# EAGLE design PCB-BI8-2x5RGB_MAX6956 (EAGLE 7.5.0)
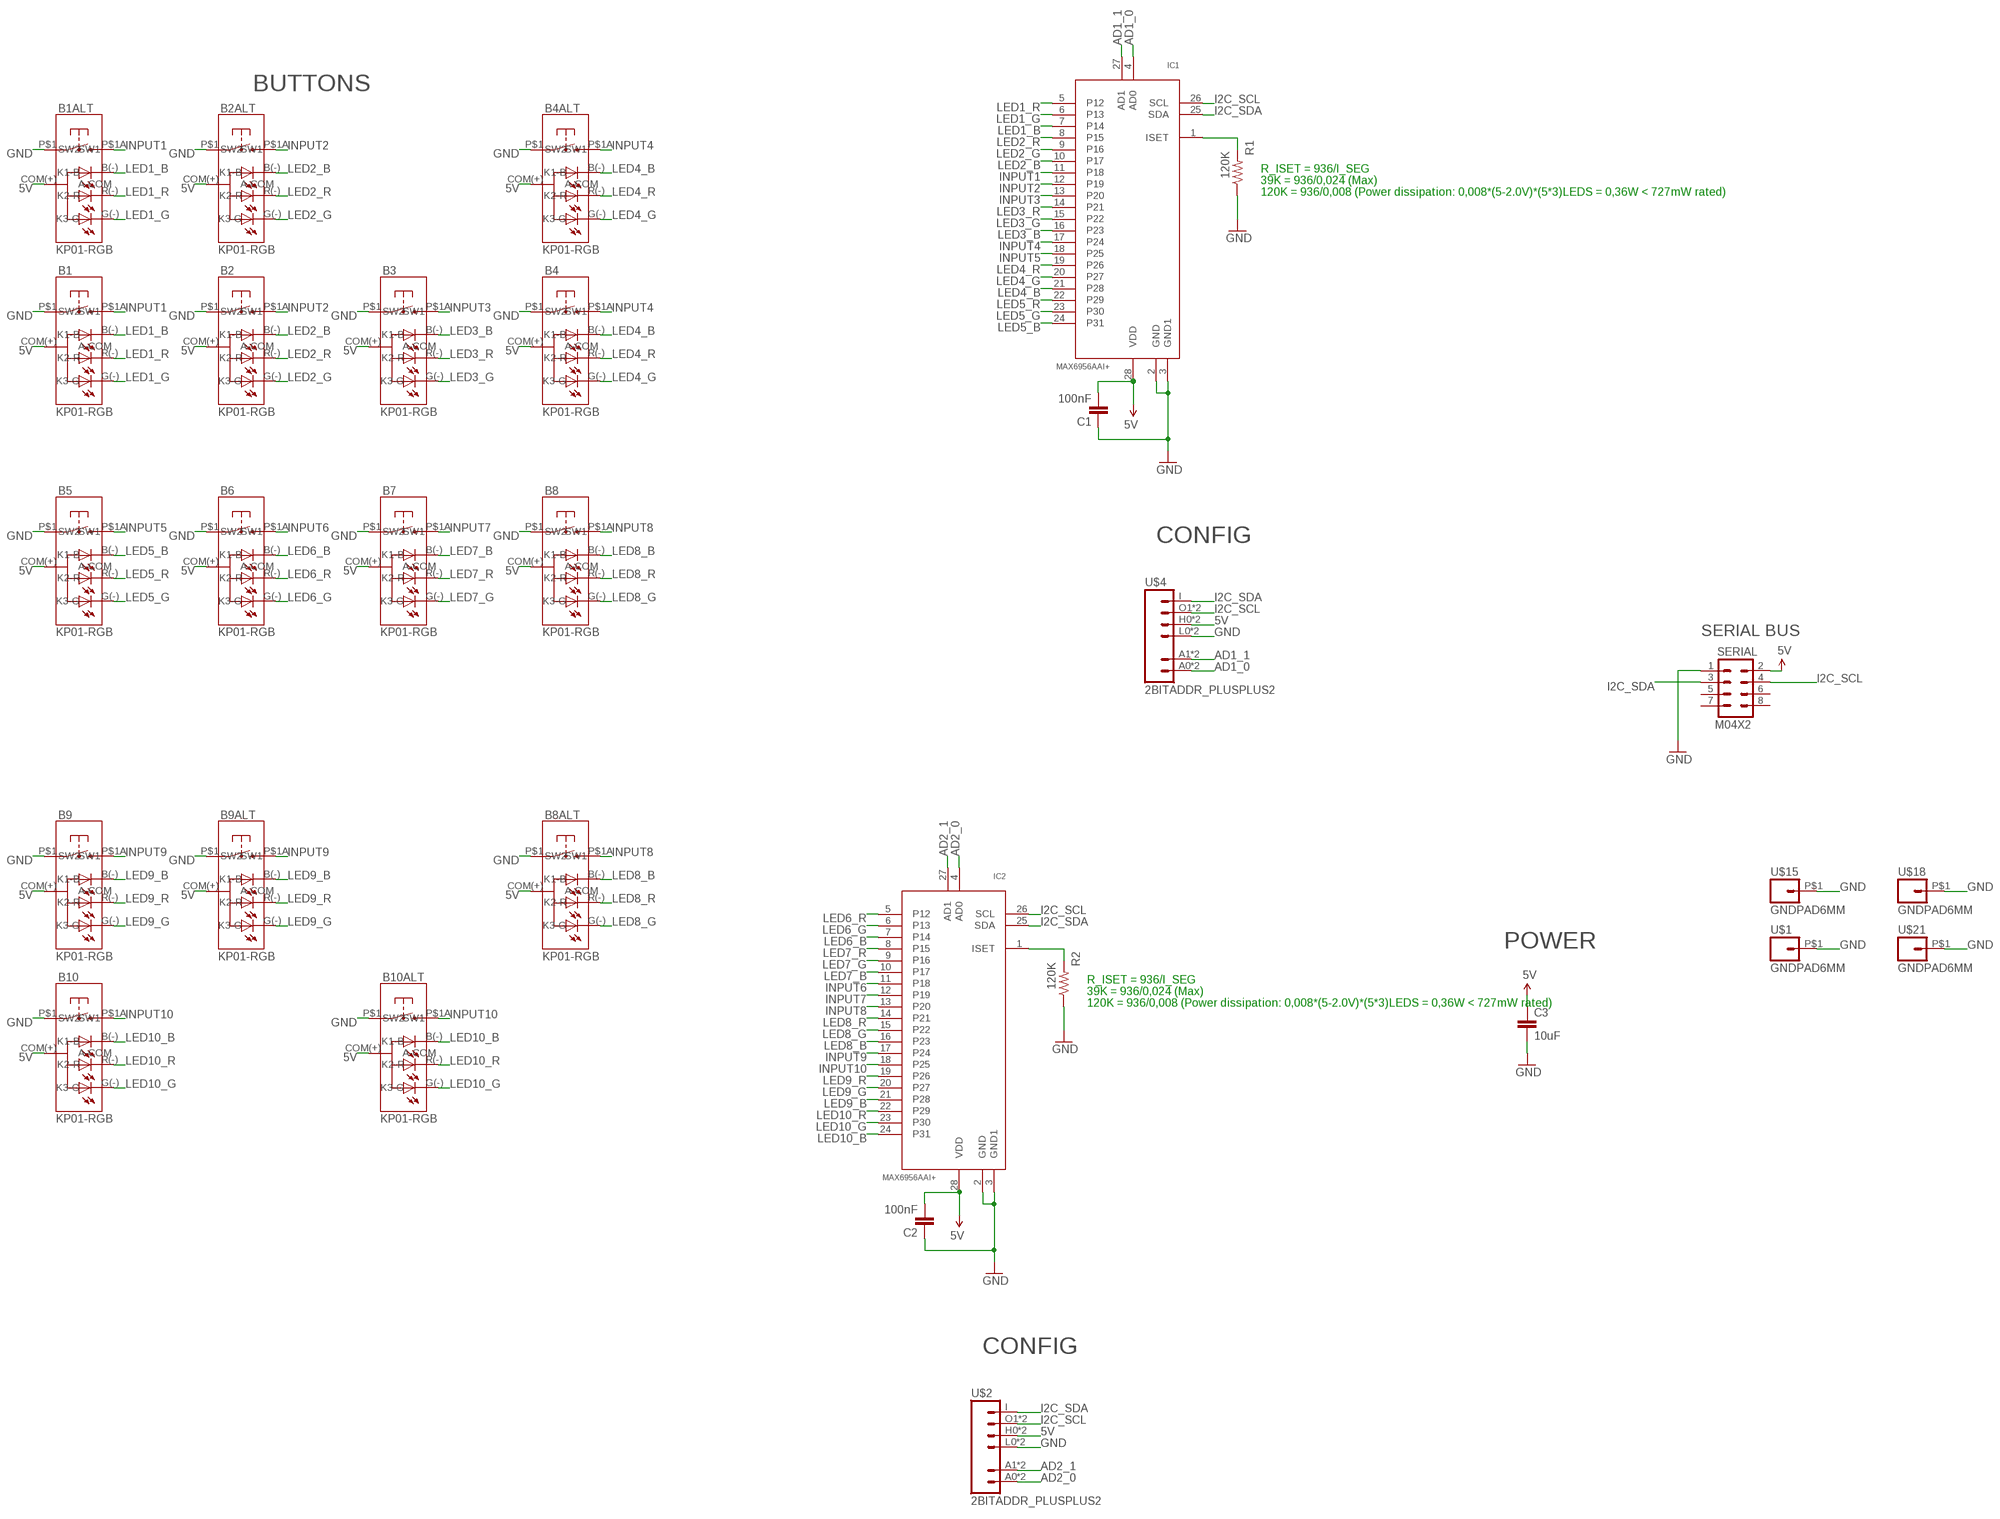
[diagram p0: schematic, sheet 1]

## Parts
B1  KP01-RGB  NKK-KP01  [NKK-KP01]
B1ALT  KP01-RGB  NKK-KP01  [NKK-KP01]
B2  KP01-RGB  NKK-KP01  [NKK-KP01]
B2ALT  KP01-RGB  NKK-KP01  [NKK-KP01]
B3  KP01-RGB  NKK-KP01  [NKK-KP01]
B4  KP01-RGB  NKK-KP01  [NKK-KP01]
B4ALT  KP01-RGB  NKK-KP01  [NKK-KP01]
B5  KP01-RGB  NKK-KP01  [NKK-KP01]
B6  KP01-RGB  NKK-KP01  [NKK-KP01]
B7  KP01-RGB  NKK-KP01  [NKK-KP01]
B8  KP01-RGB  NKK-KP01  [NKK-KP01]
B8ALT  KP01-RGB  NKK-KP01  [NKK-KP01]
B9  KP01-RGB  NKK-KP01  [NKK-KP01]
B9ALT  KP01-RGB  NKK-KP01  [NKK-KP01]
B10  KP01-RGB  NKK-KP01  [NKK-KP01]
B10ALT  KP01-RGB  NKK-KP01  [NKK-KP01]
C1  100nF  CAP0603-CAP  [0603-CAP]
C2  100nF  CAP0603-CAP  [0603-CAP]
C3  10uF  CAP0805  [0805]
IC1  MAX6956AAI+  [SSOP28]
IC2  MAX6956AAI+  [SSOP28]
R1  120K  RESISTOR0603-RES  [0603-RES]
R2  120K  RESISTOR0603-RES  [0603-RES]
SERIAL  M04X2  [2X4]
U$1  GNDPAD6MM  [3.2MMPAD6MM]
U$2  2BITADDR_PLUSPLUS2  [2BITADDR_SMALL_PLUS2]
U$4  2BITADDR_PLUSPLUS2  [2BITADDR_SMALL_PLUS2]
U$15  GNDPAD6MM  [3.2MMPAD6MM]
U$18  GNDPAD6MM  [3.2MMPAD6MM]
U$21  GNDPAD6MM  [3.2MMPAD6MM]

## Nets
5V [Power]: B1.COM(+)(A-COM) B1ALT.COM(+)(A-COM) B2.COM(+)(A-COM) B2ALT.COM(+)(A-COM) B3.COM(+)(A-COM) B4.COM(+)(A-COM) B4ALT.COM(+)(A-COM) B5.COM(+)(A-COM) B6.COM(+)(A-COM) B7.COM(+)(A-COM) B8.COM(+)(A-COM) B8ALT.COM(+)(A-COM) B9.COM(+)(A-COM) B9ALT.COM(+)(A-COM) B10.COM(+)(A-COM) B10ALT.COM(+)(A-COM) C1.2 C2.2 C3.1 IC1.28(VDD) IC2.28(VDD) SERIAL.2 U$2.H0(VCC) U$2.H1(VCC) U$4.H0(VCC) U$4.H1(VCC)
AD1_0: IC1.4(AD0) U$4.A0(A1) U$4.AS0(A1)
AD1_1: IC1.27(AD1) U$4.A1(A2) U$4.AS1(A2)
AD2_0: IC2.4(AD0) U$2.A0(A1) U$2.AS0(A1)
AD2_1: IC2.27(AD1) U$2.A1(A2) U$2.AS1(A2)
GND [Power]: B1.P$1(SW1) B1ALT.P$1(SW1) B2.P$1(SW1) B2ALT.P$1(SW1) B3.P$1(SW1) B4.P$1(SW1) B4ALT.P$1(SW1) B5.P$1(SW1) B6.P$1(SW1) B7.P$1(SW1) B8.P$1(SW1) B8ALT.P$1(SW1) B9.P$1(SW1) B9ALT.P$1(SW1) B10.P$1(SW1) B10ALT.P$1(SW1) C1.1 C2.1 C3.2 IC1.2(GND) IC1.3(GND1) IC2.2(GND) IC2.3(GND1) R1.1 R2.1 SERIAL.1 U$1.P$1 U$2.L0(GND) U$2.L1(GND) U$4.L0(GND) U$4.L1(GND) U$15.P$1 U$18.P$1 U$21.P$1
I2C_SCL: IC1.26(SCL) IC2.26(SCL) SERIAL.4 U$2.O1 U$2.O2 U$4.O1 U$4.O2
I2C_SDA: IC1.25(SDA) IC2.25(SDA) SERIAL.3 U$2.I U$4.I
INPUT1: B1.P$1A(SW2) B1ALT.P$1A(SW2) IC1.11(P18)
INPUT2: B2.P$1A(SW2) B2ALT.P$1A(SW2) IC1.12(P19)
INPUT3: B3.P$1A(SW2) IC1.13(P20)
INPUT4: B4.P$1A(SW2) B4ALT.P$1A(SW2) IC1.17(P24)
INPUT5: B5.P$1A(SW2) IC1.18(P25)
INPUT6: B6.P$1A(SW2) IC2.11(P18)
INPUT7: B7.P$1A(SW2) IC2.12(P19)
INPUT8: B8.P$1A(SW2) B8ALT.P$1A(SW2) IC2.13(P20)
INPUT9: B9.P$1A(SW2) B9ALT.P$1A(SW2) IC2.17(P24)
INPUT10: B10.P$1A(SW2) B10ALT.P$1A(SW2) IC2.18(P25)
LED1_B: B1.B(-)(K1-B) B1ALT.B(-)(K1-B) IC1.7(P14)
LED1_G: B1.G(-)(K3-G) B1ALT.G(-)(K3-G) IC1.6(P13)
LED1_R: B1.R(-)(K2-R) B1ALT.R(-)(K2-R) IC1.5(P12)
LED2_B: B2.B(-)(K1-B) B2ALT.B(-)(K1-B) IC1.10(P17)
LED2_G: B2.G(-)(K3-G) B2ALT.G(-)(K3-G) IC1.9(P16)
LED2_R: B2.R(-)(K2-R) B2ALT.R(-)(K2-R) IC1.8(P15)
LED3_B: B3.B(-)(K1-B) IC1.16(P23)
LED3_G: B3.G(-)(K3-G) IC1.15(P22)
LED3_R: B3.R(-)(K2-R) IC1.14(P21)
LED4_B: B4.B(-)(K1-B) B4ALT.B(-)(K1-B) IC1.21(P28)
LED4_G: B4.G(-)(K3-G) B4ALT.G(-)(K3-G) IC1.20(P27)
LED4_R: B4.R(-)(K2-R) B4ALT.R(-)(K2-R) IC1.19(P26)
LED5_B: B5.B(-)(K1-B) IC1.24(P31)
LED5_G: B5.G(-)(K3-G) IC1.23(P30)
LED5_R: B5.R(-)(K2-R) IC1.22(P29)
LED6_B: B6.B(-)(K1-B) IC2.7(P14)
LED6_G: B6.G(-)(K3-G) IC2.6(P13)
LED6_R: B6.R(-)(K2-R) IC2.5(P12)
LED7_B: B7.B(-)(K1-B) IC2.10(P17)
LED7_G: B7.G(-)(K3-G) IC2.9(P16)
LED7_R: B7.R(-)(K2-R) IC2.8(P15)
LED8_B: B8.B(-)(K1-B) B8ALT.B(-)(K1-B) IC2.16(P23)
LED8_G: B8.G(-)(K3-G) B8ALT.G(-)(K3-G) IC2.15(P22)
LED8_R: B8.R(-)(K2-R) B8ALT.R(-)(K2-R) IC2.14(P21)
LED9_B: B9.B(-)(K1-B) B9ALT.B(-)(K1-B) IC2.21(P28)
LED9_G: B9.G(-)(K3-G) B9ALT.G(-)(K3-G) IC2.20(P27)
LED9_R: B9.R(-)(K2-R) B9ALT.R(-)(K2-R) IC2.19(P26)
LED10_B: B10.B(-)(K1-B) B10ALT.B(-)(K1-B) IC2.24(P31)
LED10_G: B10.G(-)(K3-G) B10ALT.G(-)(K3-G) IC2.23(P30)
LED10_R: B10.R(-)(K2-R) B10ALT.R(-)(K2-R) IC2.22(P29)
N$1: IC2.1(ISET) R2.2
N$5: IC1.1(ISET) R1.2
Unconnected: SERIAL.5 SERIAL.6 SERIAL.7 SERIAL.8

## Notes on the sheet
- BUTTONS
- R_ISET = 936/I_SEG
- 39K = 936/0,024 (Max)
- 120K = 936/0,008 (Power dissipation: 0,008*(5-2.0V)*(5*3)LEDS = 0,36W < 727mW rated)
- CONFIG
- SERIAL BUS
- POWER
- R_ISET = 936/I_SEG
- 39K = 936/0,024 (Max)
- 120K = 936/0,008 (Power dissipation: 0,008*(5-2.0V)*(5*3)LEDS = 0,36W < 727mW rated)
- CONFIG

## Library data of the parts
B1 B1ALT B2 B2ALT B3 B4 B4ALT B5-B8 B8ALT B9 B9ALT B10 B10ALT = SKAARHOJ:NKK-KP01: NKK-KP01-15AC 100mA12VDC
C1-C3 = SparkFun:CAP: Capacitor Standard 0603 ceramic capacitor, and 0.1" leaded capacitor.
IC1 IC2 = SKAARHOJ:MAX6956AAI+
R1 R2 = SparkFun:RESISTOR: Resistor Basic schematic elements and footprints for 0603, 1206, and PTH resistors.
SERIAL = SparkFun:M04X2
U$1 U$15 U$18 U$21 = SKAARHOJ:GNDPAD
U$2 U$4 = SKAARHOJ:2BITADDR_PLUS

## Net classes
0 default: width 0.203 mm, drill 0.254 mm, clearance 0.203 mm
1 Power: width 0.406 mm, drill 0.61 mm, clearance 0.254 mm

## Board
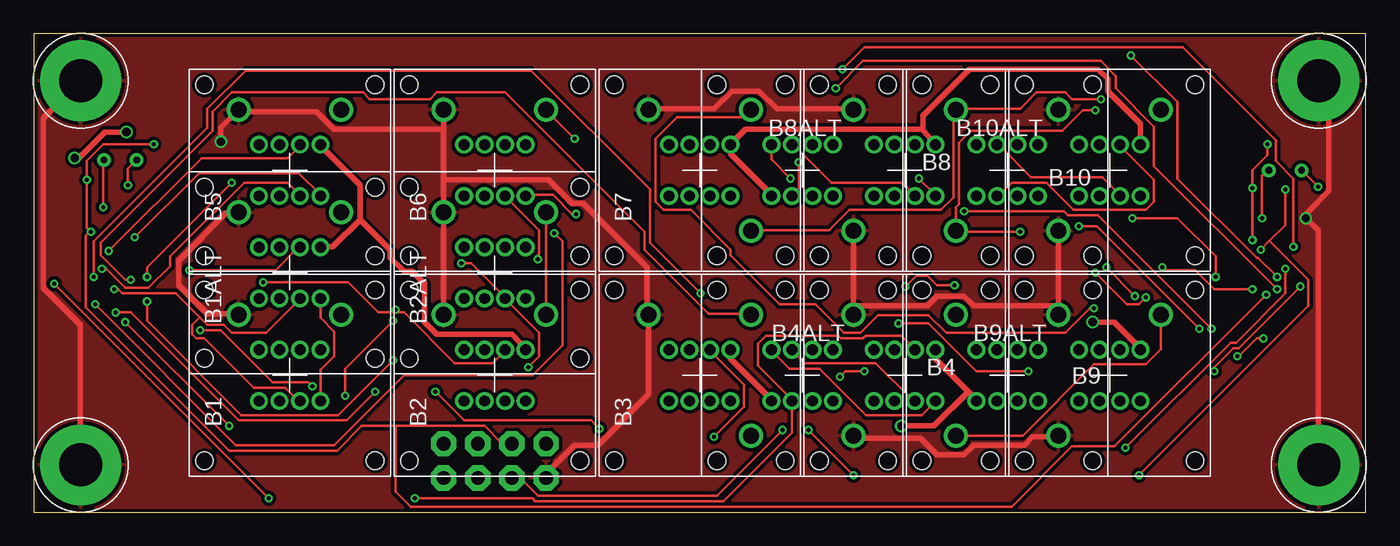
[diagram p1: board, top side]
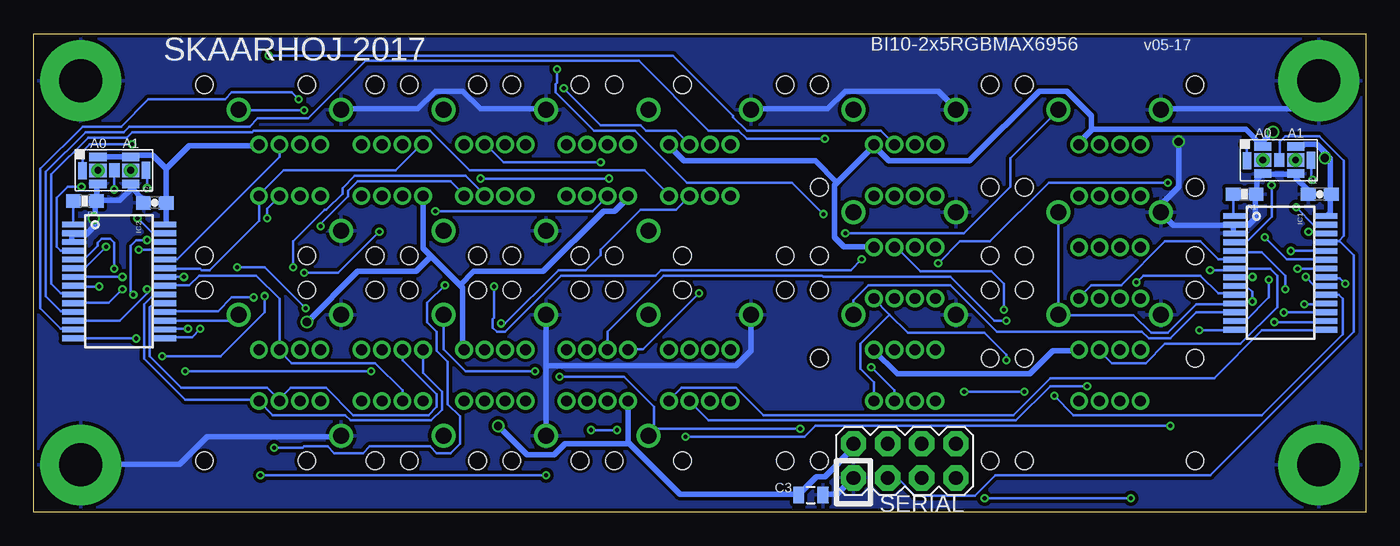
[diagram p2: board, bottom side, seen from below]

Size 99.06 x 35.56 mm. Coordinates in mm from the lower left corner, seen from the top.
Outline: 0,0 99.06,0 99.06,35.56 0,35.56 0,0
Copper layers (1*16): Top 0.035mm / dielectric 1.5mm / Bottom 0.035mm
Design rules "Fusion_eagle_rule_v1.1": minimum track width 6mil, minimum drill 12mil, track to track 6mil, track to pad 6mil, pad to pad 6mil, via to via 6mil, smd to smd 0mil, copper to edge 10mil, drill to drill 10mil, minimum pad ring 10mil, minimum via ring 6mil, stop-mask expansion 2mil, vias tented up to drill 100mil, thermal gap 10mil

### Footprints (pad centres in the part's own frame; a part is rotated, then mirrored left to right if it is on the bottom)
NKK-KP01 = drill 0.8: B(-) 1.905,-0.762; COM(+) 1.905,-2.286; G(-) -1.905,-2.286; P$3 1.905,0.762; P$4 1.905,2.286; P$7 -1.905,0.762; P$8 -1.905,2.286; R(-) -1.905,-0.762 | drill 1.2: P$1 4.496,3.81; P$1A 4.496,-3.81 | hole 1.3: -6.35,6.35; 6.35,6.35; 6.35,-6.35; -6.35,-6.35
0603-CAP = smd 1.1 x 1: 1 -0.85,0; 2 0.85,0
0805 = smd 0.8 x 1.2: 1 -0.9,0; 2 0.9,0
SSOP28 = smd 0.42 x 1.62: 1 -4.225,-3.425; 2 -3.575,-3.425; 3 -2.925,-3.425; 4 -2.275,-3.425; 5 -1.625,-3.425; 6 -0.975,-3.425; 7 -0.325,-3.425; 8 0.325,-3.425; 9 0.975,-3.425; 10 1.625,-3.425; 11 2.275,-3.425; 12 2.925,-3.425; 13 3.575,-3.425; 14 4.225,-3.425; 15 4.225,3.425; 16 3.575,3.425; 17 2.925,3.425; 18 2.275,3.425; 19 1.625,3.425; 20 0.975,3.425; 21 0.325,3.425; 22 -0.325,3.425; 23 -0.975,3.425; 24 -1.625,3.425; 25 -2.275,3.425; 26 -2.925,3.425; 27 -3.575,3.425; 28 -4.225,3.425
0603-RES = smd 1.1 x 1: 1 -0.85,0; 2 0.85,0
2X4 = drill 1.016 pad 1.88 octagon: 1 -3.81,-1.27; 2 -3.81,1.27; 3 -1.27,-1.27; 4 -1.27,1.27; 5 1.27,-1.27; 6 1.27,1.27; 7 3.81,-1.27; 8 3.81,1.27
3.2MMPAD6MM = drill 3.2 pad 6: P$1 0,0
2BITADDR_SMALL_PLUS2 = drill 0.5: A0 -1.565,0; A1 0.87,0 | smd 1.27 x 1: AS0 -1.565,0; AS1 0.87,0 | smd 1.27 x 0.635: H0 -1.565,1; H1 0.87,1; L0 -1.565,-1; L1 0.87,-1 | smd 0.762 x 1.016: I -0.336,0 | smd 0.635 x 1.27: O1 -2.727,-0.041; O2 2.004,0

### Placement (x,y rotation side)
B1  19.05,10.16 90 top
B1ALT  19.05,17.78 90 top
B2  34.29,10.16 90 top
B2ALT  34.29,17.78 90 top
B3  49.53,10.16 90 top
B4  64.77,10.16 90 top
B4ALT  57.15,10.16 270 top
B5  19.05,25.4 90 top
B6  34.29,25.4 90 top
B7  49.53,25.4 90 top
B8  64.77,25.4 90 top
B8ALT  57.15,25.4 270 top
B9  80.01,10.16 90 top
B9ALT  72.39,10.16 270 top
B10  80.01,25.4 90 top
B10ALT  72.39,25.4 270 top
C1  3.43,23.62 0 bottom
C2  90.04,22.99 0 bottom
C3  41.27,1.27 0 bottom
IC1  6.35,17.78 270 bottom
IC2  92.71,17.14 270 bottom
R1  9.02,23.62 180 bottom
R2  95.25,23.11 180 bottom
SERIAL  34.29,3.81 0 bottom
U$1  3.5,3.5 0 top
U$2  92.71,25.4 0 bottom
U$4  6.1,26.16 0 bottom
U$15  3.5,32.06 0 top
U$18  95.56,32.06 0 top
U$21  95.56,3.5 0 top

### Tracks (layer width: path | path; a pad name or v marks a point on that pad's centre or on a via)
5V  (via drill 0.61)
  Top 0.406: B3.COM(+) 51.82,11.38 54.86,8.33 B4ALT.COM(+) | B4.COM(+) 67.06,11.38 69.49,8.94 | 69.49,8.94 70.1,8.33 B9ALT.COM(+) | v78.74,14.12 80.37,14.12 81.89,12.6 81.89,12.5 82.3,12.09 B9.COM(+) | v64.52,6.4 66.95,6.4 69.49,8.94 | 24.28,21.74 22.25,19.71 21.34,19.71 B1ALT.COM(+) | 24.28,21.74 24.28,24.28 21.34,27.23 B5.COM(+) | v3.05,26.31 3.35,26.31 5.28,28.25 v6.91,28.25 | 24.28,21.74 26.52,19.51 26.52,18.9 27.53,17.88 28.14,17.88 29.06,16.97 29.06,14.12 29.97,13.21 35.56,13.21 36.17,12.6 36.17,12.5 36.58,12.09 B2.COM(+) | B8ALT.COM(+) 54.86,23.57 51.82,26.62 B7.COM(+) 51.92,27.43 52.93,28.45 66.04,28.45 | 66.04,28.45 66.65,27.84 66.65,27.74 67.06,27.33 B8.COM(+) | B10.COM(+) 82.3,28.85 79.86,31.29 79.86,32.21 79.15,32.92 69.6,32.92 66.14,29.46 66.14,28.55 66.04,28.45
  Bottom 0.406: SERIAL.2 38.1,4.78 40.23,2.64 40.84,2.64 42.16,1.32 C3.1 42.37,1.32 51,1.32 54.86,5.18 | 54.86,5.18 B4ALT.COM(+) | B10ALT.COM(+) 70.1,19.61 69.49,19 | 67.36,16.87 67.16,16.66 67.16,12.19 67.06,12.09 B4.COM(+) | 67.36,16.87 69.49,19 | v78.74,14.12 74.98,17.88 70.61,17.88 69.49,19 | v64.52,6.4 62.38,4.27 60.35,4.27 59.54,5.08 54.97,5.08 54.86,5.18 | B1.COM(+) 21.34,11.99 23.27,11.99 24.99,10.26 34.85,10.26 36.58,11.99 B2.COM(+) | IC1.28 2.85,22.05 2.64,22.25 2.64,23.57 C1.2 2.64,23.77 2.64,26.31 2.85,26.52 | 2.85,26.52 3.66,27.33 4.57,27.33 4.67,27.23 5.18,27.23 U$4.H1 | 20.32,28.45 8.94,28.45 7.72,27.23 U$4.H0 7.72,27.43 v6.91,28.25 | 20.32,28.45 21.34,27.43 B5.COM(+) | v3.05,26.31 2.85,26.52 | IC2.28 89.2,21.44 89.2,22.96 C2.2 89.2,23.16 89.2,25.5 | U$2.H0 94.18,26.42 91.85,26.42 U$2.H1 91.75,26.52 90.22,26.52 89.2,25.5 | 89.2,25.5 87.48,27.23 82.3,27.23 B10.COM(+) | 39.32,24.49 36.58,27.23 B6.COM(+) 36.47,27.13 35.46,26.11 29.46,26.11 24.28,31.29 22.25,31.29 20.42,29.46 20.42,28.55 20.32,28.45 | 39.32,24.49 39.52,24.28 39.52,20.42 38.81,19.71 36.58,19.71 B2ALT.COM(+) | 39.32,24.49 40.95,26.11 50.7,26.11 51.82,27.23 B7.COM(+) | 67.36,16.87 66.34,17.88 61.16,17.88 56.69,22.35 55.88,22.35 54.86,23.37 B8ALT.COM(+)
AD1_0  (via drill 0.3)
  Top 0.203: v7.01,24.28 7.01,25.5 7.62,26.11 U$4.A0
  Bottom 0.203: 7.72,26.21 U$4.A0 | v7.01,24.28 7.01,21.95 8.94,20.02 9.75,20.02 IC1.4
AD1_1  (via drill 0.3)
  Top 0.203: v5.18,22.66 5.18,26.11 U$4.AS1
  Bottom 0.203: 5.28,26.21 U$4.AS1 | v5.18,22.66 3.86,21.34 2.95,21.34 IC1.27
AD2_0  (via drill 0.3)
  Top 0.203: v95.5,24.18 94.28,25.4 U$2.A0
  Bottom 0.203: 94.28,25.4 U$2.A0 | v95.5,24.18 96.52,24.18 97.33,23.37 97.33,19.71 97.03,19.41 96.22,19.41 IC2.4
AD2_1  (via drill 0.3)
  Top 0.203: v91.34,21.84 91.34,24.99 91.75,25.4 U$2.AS1
  Bottom 0.203: U$2.AS1 | v91.34,21.84 90.22,20.73 89.31,20.73 IC2.27
GND  (via drill 0.61)
  Top 0.406: U$18.P$1 95.61,32 96.32,31.29 96.32,23.88 94.59,22.15 v94.59,21.84 95.5,20.93 95.5,3.56 U$21.P$1 | SERIAL.1 38.1,2.85 40.23,4.98 41.96,4.98 45.72,8.74 B3.P$1 45.62,14.83 45.62,18.19 40.84,22.96 40.03,22.96 38.3,24.69 30.48,24.69 | B10ALT.P$1 B9.P$1 76.1,15.34 69.9,15.34 69.19,16.05 67.16,16.05 66.45,15.34 61.06,15.34 B4.P$1 B8ALT.P$1 | B9ALT.P$1 76.2,5.59 74.27,5.59 73.66,4.98 69.9,4.98 69.19,4.27 67.16,4.27 65.94,5.49 61.06,5.49 60.96,5.59 B4ALT.P$1 | B1.P$1 15.24,14.73 12.9,14.73 10.77,16.87 10.77,18.69 14.33,22.25 15.24,22.25 B1ALT.P$1 | v13.92,27.53 13.92,28.55 15.24,29.87 B5.P$1 15.34,29.77 21.03,29.77 22.35,28.45 30.48,28.45 | U$1.P$1 3.45,3.56 3.45,13.92 0.71,16.66 0.71,29.26 3.45,32 U$15.P$1 | B2.P$1 B2ALT.P$1 30.48,24.69 | 30.48,24.69 30.48,28.45 | 30.48,28.45 B6.P$1 | B8.P$1 60.96,29.97 55.27,29.97 53.95,31.29 51.92,31.29 50.6,29.97 45.72,29.97 B7.P$1
  Bottom 0.406: IC2.3 96.22,20.12 96.22,20.62 IC2.2 96.01,20.62 95.2,20.62 94.49,21.34 94.49,21.84 | R2.1 94.39,23.16 94.39,24.28 94.28,24.38 U$2.L0 | 91.75,24.08 90.93,23.27 90.93,23.06 C2.1 | 91.75,24.08 91.75,24.38 U$2.L1 | 91.75,24.08 92.66,23.16 94.18,23.16 R2.1 | 94.49,21.84 94.49,22.96 R2.1 | v94.59,21.84 94.49,21.84 | SERIAL.1 39.32,1.32 40.34,1.32 C3.2 | B4.P$1 60.96,10.87 | 60.96,10.87 B4ALT.P$1 | B3.P$1 45.72,11.99 46.84,10.87 60.96,10.87 | U$21.P$1 95.5,3.56 88.19,3.56 86.16,5.59 76.2,5.59 B9ALT.P$1 | C1.1 4.37,23.67 4.37,23.98 5.18,24.79 5.18,25.09 U$4.L1 5.38,25.09 7.52,25.09 U$4.L0 7.72,25.09 8.13,24.69 8.13,23.67 R1.1 8.23,23.47 8.23,21.84 8.74,21.34 9.65,21.34 IC1.2 | IC1.3 9.86,20.73 9.86,21.34 IC1.2 | IC1.2 10.06,21.34 14.33,21.34 15.24,22.25 B1ALT.P$1 15.14,22.45 15.14,22.96 13.92,24.18 v13.92,27.53 | U$15.P$1 5.59,29.97 15.24,29.97 B5.P$1 | B7.P$1 45.72,29.97 40.03,29.97 38.71,31.29 31.8,31.29 30.48,29.97 B6.P$1 | B10.P$1 76.2,29.97 70.51,29.97 69.19,31.29 67.16,31.29 65.84,29.97 60.96,29.97 B8.P$1
  pour Top: 0,0 99.06,0 99.06,35.56 0,35.56
  pour Bottom: 0,0 99.06,0 99.06,35.56 0,35.56
I2C_SCL  (via drill 0.3)
  Top 0.203: v90.63,20.22 v90.63,24.08 90.63,25.4 91.75,26.52 v91.75,27.33 | v8.94,27.33 5.18,27.33 3.96,26.11 v3.96,24.69 3.96,21.13 v4.27,20.83 4.17,20.83 3.86,20.52 3.86,15.24 14.53,4.57 22.55,4.57 24.38,6.4 26.92,6.4 | SERIAL.4 34.85,5.08 33.53,6.4 26.92,6.4 | v91.64,16.15 80.37,4.88 77.22,4.88 72.75,0.41 28.04,0.41 26.92,1.52 26.92,6.4
  Bottom 0.203: v90.63,24.08 90.63,25.4 U$2.O2 | IC2.26 89.31,20.12 90.22,20.12 90.32,20.22 v90.63,20.22 91.44,20.22 91.85,19.81 91.85,16.36 v91.64,16.15 | v91.75,27.33 94.89,27.33 95.4,26.82 95.4,25.4 U$2.O1 | v3.96,24.69 4.06,24.79 4.06,26.11 U$4.O2 | v4.27,20.83 3.05,20.83 IC1.26 | v8.94,27.33 8.84,27.23 8.84,26.21 U$4.O1
I2C_SDA  (via drill 0.3)
  Top 0.203: v93.07,23.98 93.07,21.34 91.9,20.17 | v91.24,19.51 91.9,20.17 | 91.9,20.17 94.79,17.27 94.79,15.34 v82.19,2.74 | v57.61,6.1 v60.96,2.74 | v55.68,6.1 50.8,1.22 37.49,1.22 36.17,2.54 SERIAL.3
  Bottom 0.203: v93.07,23.98 93.07,25.4 U$2.I | v91.24,19.51 89.31,19.51 IC2.25 | 1.98,20.17 2.03,20.12 2.85,20.12 IC1.25 | 1.98,20.17 1.63,20.52 1.63,26.11 3.45,27.94 5.99,27.94 6.4,27.53 6.4,26.21 U$4.I | SERIAL.3 34.85,2.54 33.53,1.22 29.06,1.22 27.53,2.74 11.58,2.74 0.91,13.41 0.91,19.1 1.98,20.17 | v60.96,2.74 v82.19,2.74 | v55.68,6.1 v57.61,6.1
INPUT1
  Bottom 0.203: IC1.11 9.86,15.44 12.6,15.44 14.73,13.31 15.95,13.31 17.27,14.63 22.86,14.63 B1.P$1A B1ALT.P$1A
INPUT2
  Top 0.203: B2.P$1A B2ALT.P$1A
  Bottom 0.203: B2.P$1A 38.1,15.75 36.98,16.87 30.89,16.87 27.43,13.41 16.66,13.41 16.15,12.9 14.53,12.9 12.6,14.83 9.86,14.83 IC1.12
INPUT3  (via drill 0.3)
  Top 0.203: v7.21,17.27 6.81,17.27 4.98,19.1 4.98,20.02 13.31,28.35 13.31,29.77 14.73,31.19 24.49,31.19 24.99,30.68 29.46,30.68 29.97,31.19 35.05,31.19 45.41,20.83 45.41,19.51 50.19,14.73 53.34,14.73 B3.P$1A
  Bottom 0.203: v7.21,17.27 7.21,15.95 8.94,14.22 9.75,14.22 IC1.13
INPUT4  (via drill 0.3)
  Top 0.203: v6.1,14.83 7.21,14.83 15.24,6.81 23.27,6.81 v25.4,8.94 | v29.87,8.94 32,6.81 41.45,6.81 v42.06,6.2 | v61.77,10.46 60.35,10.46 v59.94,10.06
  Bottom 0.203: v6.1,14.83 2.95,14.83 IC1.17 | v29.87,8.94 v25.4,8.94 | v42.06,6.2 52.83,6.2 53.34,5.69 B4ALT.P$1A 52.93,6.2 52.93,7.82 55.17,10.06 v59.94,10.06 | B4.P$1A 68.58,12.09 66.95,10.46 v61.77,10.46
INPUT5  (via drill 0.3)
  Top 0.203: v4.57,15.44 15.04,4.98 22.35,4.98 27.53,10.16 37.08,10.16 39.32,12.39 39.32,20.12 v38.71,20.73
  Bottom 0.203: v4.57,15.44 2.95,15.44 IC1.18 | v38.71,20.73 29.87,20.73 26.42,24.18 26.42,26.31 22.86,29.87 B5.P$1A
INPUT6  (via drill 0.3)
  Top 0.203: v40.23,27.74 38.1,29.87 B6.P$1A
  Bottom 0.203: v40.23,27.74 46.02,27.74 46.63,28.35 48.87,28.35 54.05,33.53 74.37,33.53 78.64,29.26 82.4,29.26 83.01,28.65 91.95,28.65 92.35,28.25 95.2,28.25 98.15,25.3 98.15,16.05 97.03,14.94 96.22,14.94 IC2.11
INPUT7  (via drill 0.3)
  Top 0.203: v90.63,16.56 87.78,16.56 86.36,17.98 84.12,17.98 v83.92,18.19 | v78.84,15.14 78.54,15.14 76.71,13.31 67.87,13.31 66.55,14.63 62.79,14.63 61.47,13.31 60.25,13.31 58.12,15.44 55.47,15.44 51.82,19.1 51.82,19.51 48.87,22.45 46.84,22.45 46.23,23.06 46.23,27.74 47.85,29.36 52.83,29.36 53.34,29.87 B7.P$1A
  Bottom 0.203: v90.63,16.56 90.63,16.26 92.66,14.22 96.11,14.22 IC2.12 | v83.92,18.19 81.89,18.19 v78.84,15.14
INPUT8  (via drill 0.3)
  Top 0.203: v79.35,30.68 77.22,30.68 76.71,31.19 74.57,31.19 73.36,29.97 68.58,29.97 B8.P$1A 68.58,29.87 68.38,29.67 68.38,23.37 67.46,22.45 60.66,22.45 59.13,20.93 53.34,20.93 B8ALT.P$1A
  Bottom 0.203: v79.35,30.68 79.86,31.19 84.33,31.19 84.84,30.68 90.53,30.68 92.56,28.65 95.4,28.65 98.55,25.5 98.55,15.14 97.03,13.61 96.22,13.61 IC2.13
INPUT9
  Top 0.203: B9.P$1A 83.82,12.09 82.7,10.97 78.84,10.97 73.56,5.69 68.58,5.69 B9ALT.P$1A
  Bottom 0.203: IC2.17 89.2,14.22 84.23,14.22 83.82,14.63 B9.P$1A
INPUT10  (via drill 0.3)
  Top 0.203: v82.7,15.95 82.19,15.44 81.28,15.44 v78.94,17.78 | v73.36,20.83 68.58,20.83 B10ALT.P$1A 68.58,22.66 68.78,22.86 68.78,27.43 69.7,28.35 76.5,28.35 78.03,29.87 v78.94,29.87
  Bottom 0.203: v82.7,15.95 84.33,15.95 85.34,14.94 89.2,14.94 IC2.18 | v78.94,17.78 76.4,17.78 v73.36,20.83 | v78.94,29.87 83.82,29.87 B10.P$1A
LED1_B  (via drill 0.3)
  Top 0.203: v11.58,17.98 17.98,17.98 19.61,19.61 19.81,19.61 B1ALT.B(-)
  Bottom 0.203: B1.B(-) 19.81,11.99 18.9,11.07 16.36,11.07 14.94,12.5 9.35,12.5 6.6,15.24 6.6,17.58 7.11,18.09 9.75,18.09 IC1.7 9.75,17.98 v11.58,17.98
LED1_G
  Top 0.203: B1.G(-) 21.34,10.57 22.35,11.58 22.35,13.41 21.34,14.43 B1ALT.G(-)
  Bottom 0.203: IC1.6 9.86,18.8 10.97,18.8 12.29,20.12 14.94,20.12 18.19,16.87 20.42,16.87 21.34,15.95 B1ALT.G(-)
LED1_R  (via drill 0.3)
  Top 0.203: v5.99,16.56 6.3,16.56 6.6,16.26 10.57,16.26 12.34,14.48 | 12.34,14.48 12.9,13.92 14.12,13.92 14.73,13.31 17.27,13.31 19.81,15.85 B1ALT.R(-) | 12.34,14.48 11.79,13.92 11.79,13.21 12.09,12.9 12.7,12.9 16.36,9.25 18.69,9.25 19.61,8.33 19.81,8.33 B1.R(-)
  Bottom 0.203: v5.99,16.56 5.99,17.58 7.72,19.3 9.75,19.3 IC1.5
LED2_B  (via drill 0.3)
  Top 0.203: v17.07,17.07 23.37,17.07 25.6,14.83 26.92,14.83 | 26.92,14.83 27.53,14.83 31.29,11.07 34.14,11.07 35.05,11.99 B2.B(-) | 26.92,14.83 v26.92,15.04
  Bottom 0.203: v17.07,17.07 16.56,17.58 12.29,17.58 10.97,16.26 9.86,16.26 IC1.10 | v26.92,15.04 26.92,16.97 27.84,17.88 33.12,17.88 34.85,19.61 35.05,19.61 B2ALT.B(-)
LED2_G  (via drill 0.3)
  Top 0.203: v8.43,15.65 8.43,14.22 15.44,7.21 22.66,7.21 v26.72,11.28
  Bottom 0.203: v8.43,15.65 8.43,16.36 8.84,16.76 9.75,16.76 IC1.9 | v26.72,11.28 26.72,11.68 28.35,13.31 34.04,13.31 35.41,14.68 | 35.41,14.68 36.58,15.85 B2ALT.G(-) | B2.G(-) 36.58,9.65 37.59,10.67 37.59,12.5 35.41,14.68
LED2_R  (via drill 0.3)
  Top 0.203: v8.43,17.48 8.43,18.19 v14.73,24.49 | v31.8,18.49 32.51,18.49 35.05,15.95 B2ALT.R(-) 35.05,15.85 37.59,13.31 37.59,11.58 v36.78,10.77
  Bottom 0.203: v8.43,17.48 9.75,17.48 IC1.8 | v14.73,24.49 23.57,24.49 27.94,20.12 30.18,20.12 v31.8,18.49 | B2.R(-) 35.05,9.04 v36.78,10.77
LED3_B  (via drill 0.3)
  Top 0.203: v14.53,6.4 v6.81,14.12 | v50.6,5.59 52.83,7.82 52.83,9.45 50.29,11.99 B3.B(-)
  Bottom 0.203: v6.81,14.12 2.95,14.12 IC1.16 | v14.53,6.4 40.95,6.4 41.76,5.59 v50.6,5.59
LED3_G
  Bottom 0.203: IC1.15 2.95,13.51 7.72,13.51 11.28,9.96 23.47,9.96 26.21,7.21 44.81,7.21 46.84,9.25 50.9,9.25 51.82,8.33 B3.G(-)
LED3_R  (via drill 0.3)
  Top 0.203: v12.39,13.51 13.92,13.51 17.78,9.65 20.42,9.65 v20.73,9.35
  Bottom 0.203: v12.39,13.51 9.86,13.51 IC1.14 | v20.73,9.35 23.47,9.35 26.01,6.81 48.87,6.81 50.29,8.23 B3.R(-)
LED4_B  (via drill 0.3)
  Top 0.203: v17.48,1.02 v1.52,16.97 | v28.35,1.02 37.08,1.02 37.29,0.81 51.31,0.81 56.39,5.89 B4ALT.B(-) 56.39,8.33 53.85,10.87 53.85,12.5 54.46,13.11 59.84,13.11 60.05,12.9 61.67,12.9 61.87,13.11 64.52,13.11 65.53,12.09 B4.B(-)
  Bottom 0.203: v1.52,16.97 1.93,17.37 2.85,17.37 IC1.21 | v28.35,1.02 v17.48,1.02
LED4_G  (via drill 0.3)
  Top 0.203: v4.47,17.48 4.47,20.12 12.9,28.55 12.9,29.97 15.75,32.82 36.98,32.82 45.82,23.98 45.82,20.02 v49.58,16.26 | B4.G(-) 67.06,8.23 66.04,7.21 61.87,7.21 58.42,10.67 56.19,10.67 54.86,11.99 B4ALT.G(-)
  Bottom 0.203: v4.47,17.48 3.86,16.87 2.95,16.87 IC1.20 | v49.58,16.26 53.75,12.09 54.86,12.09 B4ALT.G(-)
LED4_R  (via drill 0.3)
  Top 0.203: v23.16,8.64 23.16,10.67 v26.72,14.22 | B4.R(-) 65.53,8.33 65.33,8.33 62.59,11.07 57.3,11.07 56.39,11.99 B4ALT.R(-)
  Bottom 0.203: v23.16,8.64 21.74,7.21 7.72,7.21 1.73,13.21 1.73,15.85 2.03,16.15 2.85,16.15 IC1.19 | v26.72,14.22 27.64,14.22 30.89,17.48 40.34,17.48 40.44,17.58 52.22,17.58 56.39,13.41 B4ALT.R(-)
LED5_B  (via drill 0.3)
  Top 0.203: v5.59,19.41 12.5,26.31 18.9,26.31 19.81,27.23 B5.B(-)
  Bottom 0.203: v5.59,19.41 2.95,19.41 IC1.24
LED5_G  (via drill 0.3)
  Top 0.203: v7.52,20.42 12.29,25.2 19.71,25.2 21.34,23.57 B5.G(-)
  Bottom 0.203: v7.52,20.42 5.89,18.8 2.95,18.8 IC1.23
LED5_R  (via drill 0.3)
  Top 0.203: v5.08,18.09 5.38,18.09 6.81,16.66 8.53,16.66 10.16,18.29 10.16,19 15.65,24.49 18.9,24.49 19.81,23.57 B5.R(-)
  Bottom 0.203: v5.08,18.09 2.95,18.09 IC1.22
LED6_B  (via drill 0.3)
  Top 0.203: v92.46,17.48 91.03,18.9 90.93,18.9 85.04,24.79 85.04,30.48 v81.58,33.93
  Bottom 0.203: v92.46,17.48 96.11,17.48 IC2.7 | v81.58,33.93 51.51,33.93 47.04,29.46 47.04,29.36 46.02,28.35 36.07,28.35 35.05,27.33 B6.B(-)
LED6_G  (via drill 0.3)
  Top 0.203: v93.67,19.71 93.67,24.79 92.35,26.11 92.35,27.64 85.45,34.54 61.77,34.54 v60.15,32.92 | v40.34,22.15 40.03,22.15 38.61,23.57 36.58,23.57 B6.G(-)
  Bottom 0.203: v93.67,19.71 95.2,18.19 96.11,18.19 IC2.6 | v60.15,32.92 60.15,31.9 60.25,31.8 60.25,31.19 57.4,28.35 54.36,28.35 50.49,24.49 42.67,24.49 v40.34,22.15
LED6_R  (via drill 0.3)
  Top 0.203: v93.07,18.09 93.07,16.26 89.41,12.6 89,12.6 v81.18,4.78 | v68.48,16.87 67.16,16.87 66.45,17.58 65.63,17.58 v64.82,16.76 | v37.49,18.8 37.49,19.1 37.59,19.2 37.59,20.93 35.05,23.47 B6.R(-)
  Bottom 0.203: v93.07,18.09 93.07,20.02 93.37,20.32 93.98,20.32 94.28,20.02 94.28,19.81 95.3,18.8 96.11,18.8 IC2.5 | v81.18,4.78 79.05,4.78 78.94,4.88 77.22,4.88 76.71,4.37 74.57,4.37 74.07,4.88 69.6,4.88 69.09,4.37 68.07,4.37 67.36,5.08 67.36,7.11 68.28,8.03 68.28,11.18 69.09,11.99 69.09,13.41 69.8,14.12 69.8,15.54 v68.48,16.87 | v64.82,16.76 64.82,14.43 64.92,14.33 64.92,13.72 64.62,13.41 64.01,13.41 59.84,17.58 52.83,17.58 52.43,17.98 38.3,17.98 v37.49,18.8
LED7_B  (via drill 0.3)
  Top 0.203: v92.46,16.56 83.31,25.7 83.31,28.65 80.47,31.5 80.47,32.41 79.35,33.53 61.67,33.53 v59.64,31.5
  Bottom 0.203: v92.46,16.56 93.47,15.54 96.11,15.54 IC2.10 | v59.64,31.5 56.9,28.75 53.95,28.75 53.54,28.35 51.31,28.35 50.29,27.33 B7.B(-)
LED7_G
  Bottom 0.203: IC2.9 96.22,16.26 97.03,16.26 97.74,16.97 97.74,25.09 95,27.84 92.15,27.84 91.75,28.25 82.8,28.25 82.7,28.35 69.6,28.35 66.65,25.4 53.65,25.4 51.82,23.57 B7.G(-)
LED7_R  (via drill 0.3)
  Top 0.203: v94.18,16.76 89.61,12.19 89.2,12.19 87.78,10.77 v87.78,10.46 | v73.97,10.46 70.1,10.46 66.55,14.02 v64.31,14.02
  Bottom 0.203: v94.18,16.76 96.11,16.76 IC2.8 | v73.97,10.46 v87.78,10.46 | v64.31,14.02 64.01,14.02 60.05,17.98 58.01,17.98 56.9,19.1 56.9,19.51 53.95,22.45 51.31,22.45 50.29,23.47 B7.R(-)
LED8_B  (via drill 0.3)
  Top 0.203: v87.58,13.61 79.15,22.05 76.91,22.05 76.61,22.35 v69.19,22.35 | v56.9,26.01 56.9,24.08 56.39,23.57 B8ALT.B(-)
  Bottom 0.203: v87.58,13.61 89.2,13.61 IC2.16 | v69.19,22.35 57.51,22.35 56.39,23.47 B8ALT.B(-) | v56.9,26.01 64.11,26.01 65.33,27.23 65.53,27.23 B8.B(-)
LED8_G  (via drill 0.3)
  Top 0.203: v86.67,13.61 79.05,21.23 v77.72,21.23 | B8ALT.G(-) 54.86,26.21 v56.29,24.79 | v65.84,24.79 67.06,23.57 B8.G(-)
  Bottom 0.203: v86.67,13.61 87.27,13.01 89.2,13.01 IC2.15 | v77.72,21.23 77.72,21.44 75.69,23.47 75.69,23.88 74.98,24.59 68.07,24.59 67.06,23.57 B8.G(-) | v65.84,24.79 v56.29,24.79
LED8_R  (via drill 0.3)
  Top 0.203: v91.44,12.9 90.93,12.9 89.61,11.58 v89.51,11.58 | v79.76,18.19 v81.89,16.05 | B8ALT.R(-) 56.39,27.23 56.59,27.23 59.33,24.49 64.62,24.49 65.53,23.57 B8.R(-)
  Bottom 0.203: v91.44,12.9 96.11,12.9 IC2.14 | v89.51,11.58 85.14,11.58 81.89,14.83 v81.89,16.05 | v79.76,18.19 79.76,20.12 77.42,22.45 77.32,22.45 76.1,23.67 76.1,24.08 75.18,24.99 66.95,24.99 65.53,23.57 B8.R(-)
LED9_B
  Bottom 0.203: IC2.21 89.2,16.87 87.48,16.87 86.77,17.58 82.5,17.58 80.77,15.85 B9.B(-) 80.77,11.99 79.86,11.07 73.66,11.07 71.63,9.04 B9ALT.B(-)
LED9_G
  Bottom 0.203: IC2.20 89.31,16.15 90.12,16.15 90.83,15.44 90.83,11.38 87.78,8.33 82.3,8.33 B9.G(-) 82.3,8.23 81.28,7.21 75.89,7.21 75.49,6.81 69.49,6.81 68.68,7.62 68.68,8.94 70.1,10.36 B9ALT.G(-)
LED9_R
  Bottom 0.203: IC2.19 89.31,15.44 90.22,15.44 90.42,15.24 90.42,11.58 88.09,9.25 81.69,9.25 80.77,8.33 B9.R(-) 80.77,8.43 79.96,9.25 77.32,9.25 75.29,7.21 69.7,7.21 69.09,7.82 69.09,8.74 71.63,11.28 B9ALT.R(-)
LED10_B
  Top 0.203: B10ALT.B(-) 71.63,23.57 71.83,23.57 72.75,24.49 75.29,24.49 77.32,22.45 82.7,22.45 83.31,23.06 83.31,24.69 80.77,27.23 B10.B(-)
  Bottom 0.203: B10.B(-) 80.77,26.42 88.39,18.8 89.2,18.8 IC2.24
LED10_G
  Bottom 0.203: IC2.23 89.2,18.09 86.67,18.09 86.56,17.98 85.95,17.98 82.3,21.64 B10.G(-) 82.3,23.57 80.47,25.4 72.14,25.4 70.31,27.23 70.1,27.23 B10ALT.G(-)
LED10_R  (via drill 0.3)
  Top 0.203: v87.88,17.48 87.88,19 85.04,21.84 v81.69,21.84 | B10ALT.R(-) 71.63,27.23 71.83,27.23 74.17,24.89 79.45,24.89 80.77,23.57 B10.R(-)
  Bottom 0.203: v87.88,17.48 89.2,17.48 IC2.22 | v81.69,21.84 81.69,22.55 80.77,23.47 B10.R(-)
N$1
  Bottom 0.203: R2.2 96.11,23.06 96.11,21.44 IC2.1
N$5
  Bottom 0.203: R1.2 9.86,23.57 9.86,22.05 IC1.1

### Text on the board
_bsilk: v05-17 | BI10-2x5RGBMAX6956 | SKAARHOJ 2017